# Altium schematic sheet dv_analog_interface_ch_old.SchDoc
size 410 x 297 mm; SheetNumber: 2; SheetTotal: 2; PageSetup: Record=PageOptions|CenterHorizontal=True|CenterVertical=True|PrintScale=1.00|XCorrection=1.00|YCorrection=1.00|PrintKind=1|BorderSize=5000000|LeftOffset=0|BottomOffset=0|Orientation=2|PaperLength=1000|PaperWidth=1000|Scale=100|PaperSource=15|PrintQuality=1200|MediaType=1|DitherType=10|PaperKind=A3|PrintScaleMode=1; Weight: -; ScaleFactor: -; NormInspection: Норм.Контр.
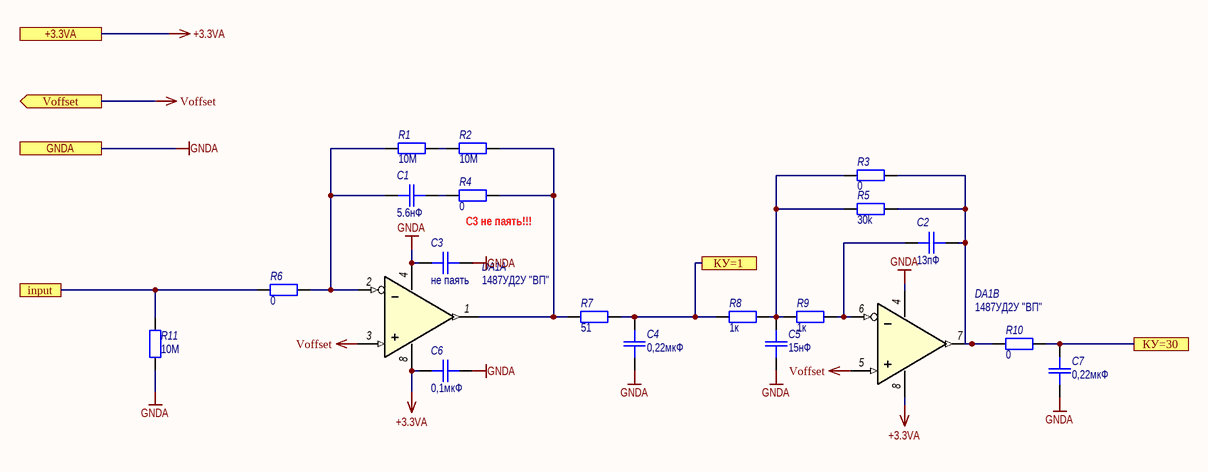
[diagram p0: dv_analog_interface_ch_old.SchDoc]

## Parts
C1  value 5.6нФ  [SMD_C0805]  (hidden comment: K10-79)
C2  value 13пФ  [SMD_C0805]  (hidden comment: K10-79)
C3  value не паять  [SMD_C0805]  (hidden comment: K10-79)
C4  value 0,22мкФ  [SMD_C0805]  (hidden comment: K10-79)
C5  value 15нФ  [SMD_C0805]  (hidden comment: K10-79)
C6  value 0,1мкФ  [SMD_C0805]  (hidden comment: K10-79)
C7  value 0,22мкФ  [SMD_C0805]  (hidden comment: K10-79)
DA1  Наименование: 1487УД2У "ВП"  [HO2.8-1B]  (hidden comment: 1487UD2U)  (parts A,B of 2)
R1  value 10M  [SMD_0805]  (hidden comment: OSM R1-12)
R2  value 10M  [SMD_0805]  (hidden comment: OSM R1-12)
R3  value 0  [SMD_0805]  (hidden comment: OSM R1-12)
R4  value 0  [SMD_0805]  (hidden comment: OSM R1-12)
R5  value 30k  [SMD_0805]  (hidden comment: OSM R1-12)
R6  value 0  [SMD_0805]  (hidden comment: OSM R1-12)
R7  value 51  [SMD_0805]  (hidden comment: OSM R1-12)
R8  value 1к  [SMD_0805]  (hidden comment: OSM R1-12)
R9  value 1к  [SMD_0805]  (hidden comment: OSM R1-12)
R10  value 0  [SMD_0805]  (hidden comment: OSM R1-12)
R11  value 10M  [SMD_0805]  (hidden comment: OSM R1-12)

## Ports
+3.3VA, GNDA, input, Voffset (out), КУ=1, КУ=30

## Nets
+3.3VA: C6.1 DA1.8(Vss+) ; port +3.3VA
GNDA: C3.1 C3.2 C4.1 C5.1 C6.2 C7.1 DA1.4(Vss-) R11.1 ; port GNDA
Voffset: DA1.3(In+) DA1.5(In+) ; port Voffset
input: R6.1 R11.2 ; port input
КУ=1: C4.2 R7.2 R8.1 ; port КУ=1
КУ=30: C7.2 R10.2 ; port КУ=30
NetC1_1: C1.1 DA1.2(In-) R1.1 R6.2
NetC1_2: C1.2 R4.1
NetC2_1: C2.1 DA1.7(Out) R3.2 R5.2 R10.1
NetC2_2: C2.2 DA1.6(In-) R9.2
NetC5_2: C5.2 R3.1 R5.1 R8.2 R9.1
NetDA1_1: DA1.1(Out) R2.2 R4.2 R7.1
NetR1_2: R1.2 R2.1

## Notes on the sheet
- С3 не паять!!!
- Подп. и дата
- Инв. № дубл.
- Взам. инв. №
- Инв. № подл.
- Изм.
- Лист
- № докум.
- Подп.
- Дата
- Форма 2а ГОСТ 2.104-2006
- Копировал
- Формат А3

## Library data of the parts
C1-C7 = Capacitor: Назначение: SMD-конденсатор; Наименование: К10-79; Потребление, Вт: 0; Напряжение: В; Точность: %
DA1 = 1487UD2U: Сдвоенный операционный усилитель; Потребление, Вт: 0,01; Назначение: Сдвоенный операционный усилитель
R1-R11 = Resistor: Наименование: ОСМ Р1-12; Назначение: SMD-резистор; Потребление, Вт: 0,001; Точность: %